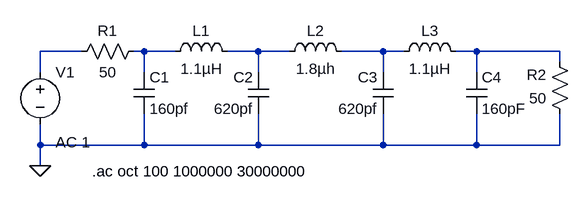
[diagram p0: schematic BUTTER07.asc]
BUTTER07.asc, the LTspice schematic file:
Version 4
SHEET 1 880 680
WIRE 80 112 16 112
WIRE 176 112 160 112
WIRE 224 112 176 112
WIRE 352 112 304 112
WIRE 400 112 352 112
WIRE 544 112 480 112
WIRE 576 112 544 112
WIRE 688 112 656 112
WIRE 816 112 688 112
WIRE 816 128 816 112
WIRE 16 144 16 112
WIRE 176 144 176 112
WIRE 352 144 352 112
WIRE 544 144 544 112
WIRE 688 144 688 112
WIRE 16 256 16 224
WIRE 176 256 176 208
WIRE 176 256 16 256
WIRE 352 256 352 208
WIRE 352 256 176 256
WIRE 544 256 544 208
WIRE 544 256 352 256
WIRE 688 256 688 208
WIRE 688 256 544 256
WIRE 816 256 816 208
WIRE 816 256 688 256
WIRE 16 288 16 256
FLAG 16 288 0
SYMBOL voltage 16 128 R0
WINDOW 123 24 124 Left 2
WINDOW 39 0 0 Left 0
SYMATTR Value2 AC 1
SYMATTR InstName V1
SYMATTR Value ""
SYMBOL res 176 96 R90
WINDOW 0 0 56 VBottom 2
WINDOW 3 32 56 VTop 2
SYMATTR InstName R1
SYMATTR Value 50
SYMBOL res 832 224 R180
WINDOW 0 36 76 Left 2
WINDOW 3 36 40 Left 2
SYMATTR InstName R2
SYMATTR Value 50
SYMBOL cap 160 144 R0
SYMATTR InstName C1
SYMATTR Value 160pf
SYMBOL cap 368 208 R180
WINDOW 0 24 56 Left 2
WINDOW 3 24 8 Left 2
SYMATTR InstName C2
SYMATTR Value 620pf
SYMBOL cap 560 208 R180
WINDOW 0 24 56 Left 2
WINDOW 3 24 8 Left 2
SYMATTR InstName C3
SYMATTR Value 620pf
SYMBOL ind 208 128 R270
WINDOW 0 32 56 VTop 2
WINDOW 3 5 56 VBottom 2
SYMATTR InstName L1
SYMATTR Value 1.1µH
SYMBOL ind 384 128 R270
WINDOW 0 32 56 VTop 2
WINDOW 3 5 56 VBottom 2
SYMATTR InstName L2
SYMATTR Value 1.8µh
SYMBOL ind 560 128 R270
WINDOW 0 32 56 VTop 2
WINDOW 3 5 56 VBottom 2
SYMATTR InstName L3
SYMATTR Value 1.1µH
SYMBOL cap 672 144 R0
SYMATTR InstName C4
SYMATTR Value 160pF
TEXT 96 296 Left 2 !.ac oct 100 1000000 30000000

The netlist it stands for:
* BUTTER07.asc
V1 N001 0 AC 1
R1 N002 N001 50
R2 0 N005 50
C1 N002 0 160pf
C2 0 N003 620pf
C3 0 N004 620pf
L1 N002 N003 1.1µH
L2 N003 N004 1.8µh
L3 N004 N005 1.1µH
C4 N005 0 160pF
.ac oct 100 1000000 30000000
.backanno
.end